# EAGLE design MoleNet_v5.0 (EAGLE 9.6.2)
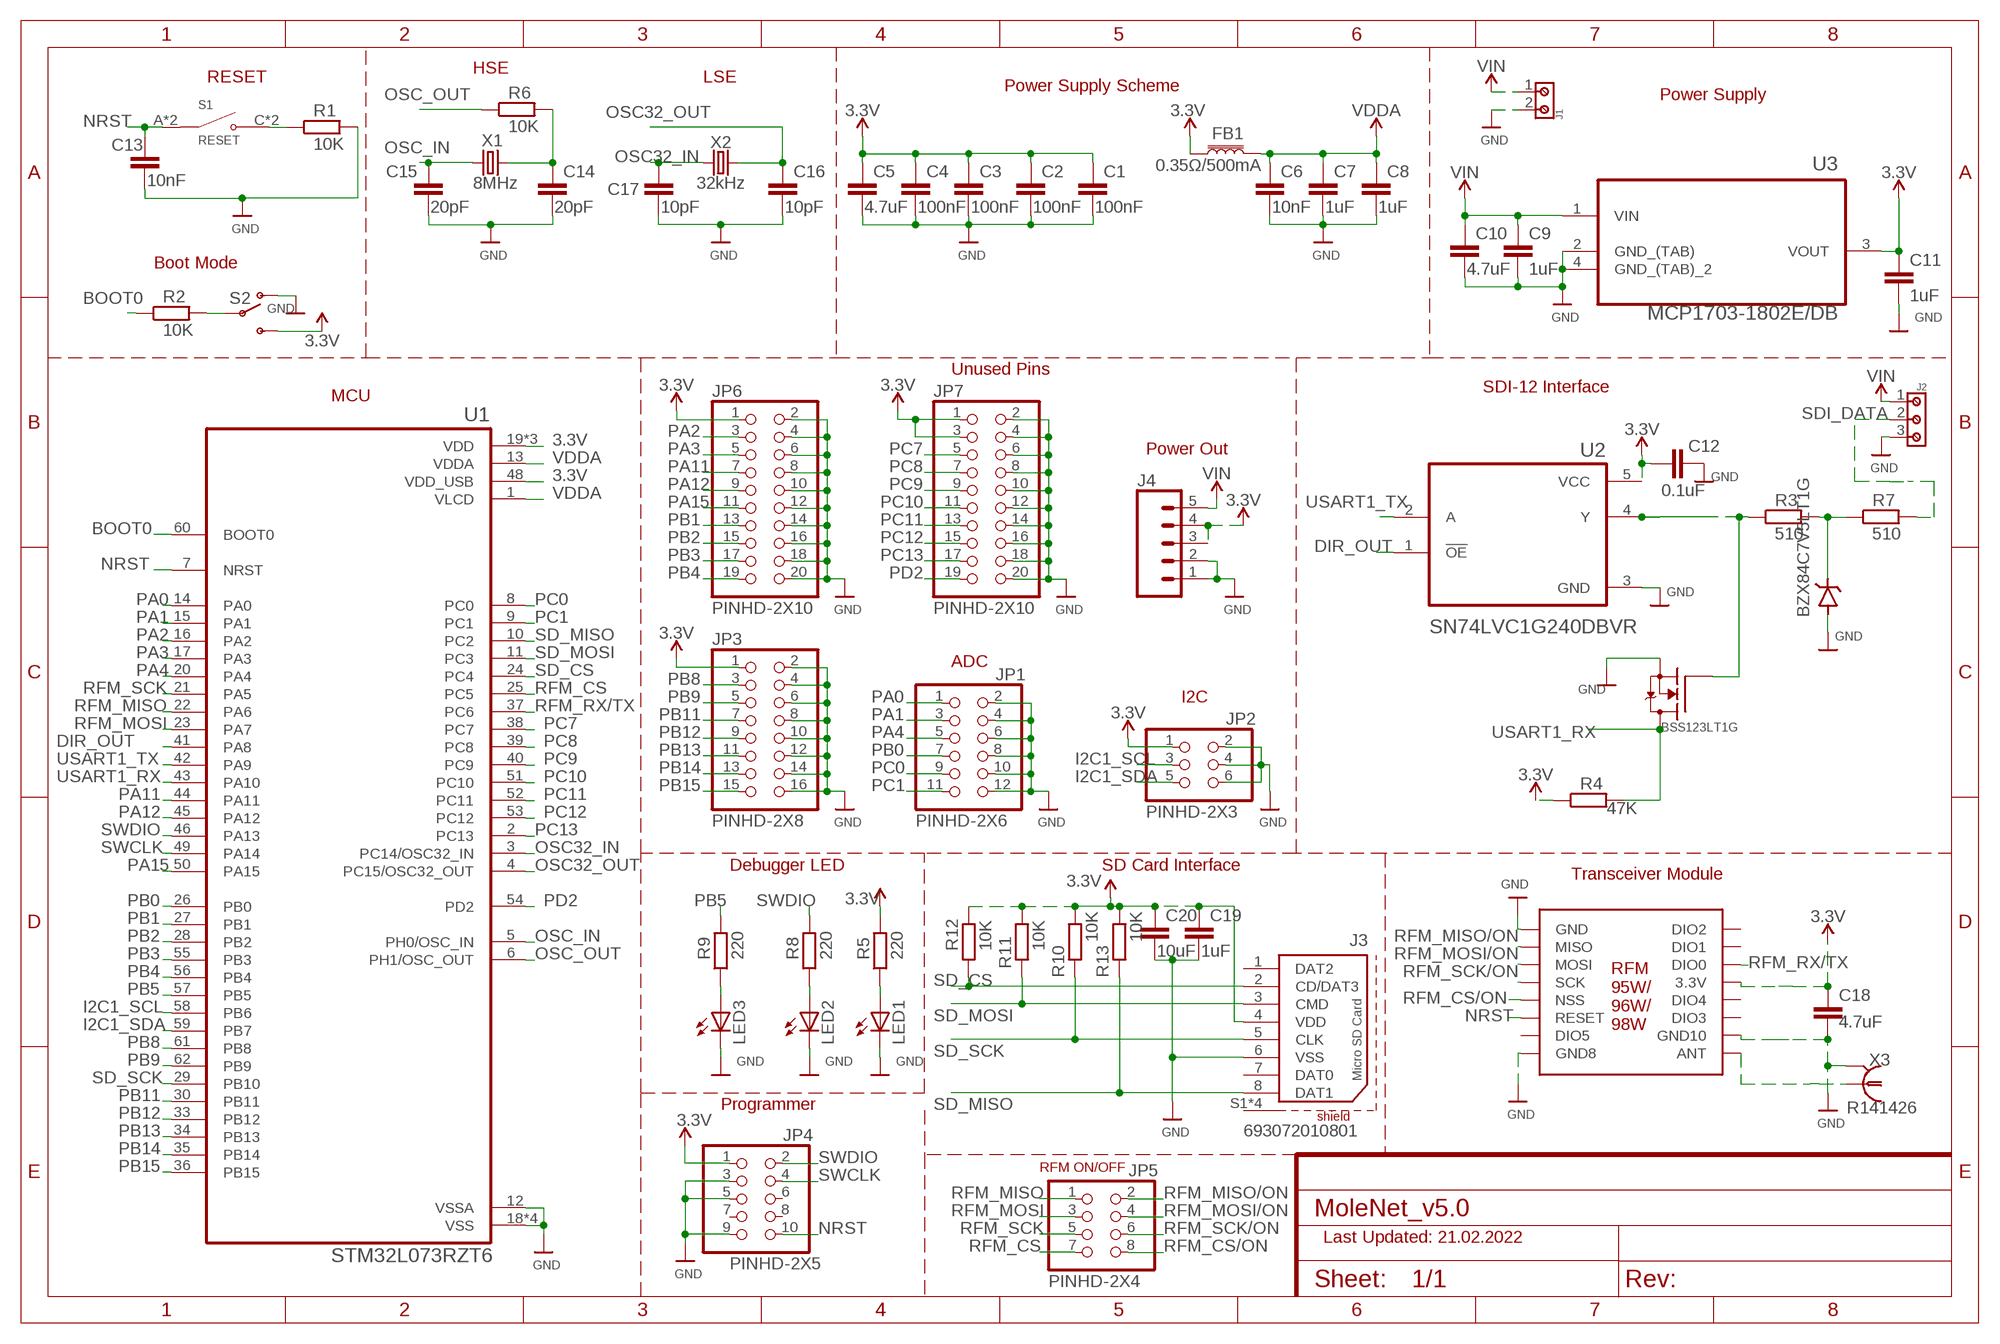
[diagram p0: schematic, sheet 1]

## Parts
C1  100nF  C-EUC0805  [C0805]
C2  100nF  C-EUC0805  [C0805]
C3  100nF  C-EUC0805  [C0805]
C4  100nF  C-EUC0805  [C0805]
C5  4.7uF  C-EUC0805  [C0805]
C6  10nF  C-EUC0805  [C0805]
C7  1uF  C-EUC0805  [C0805]
C8  1uF  C-EUC0805  [C0805]
C9  1uF  C-EUC0805  [C0805]
C10  4.7uF  C-EUC0805  [C0805]
C11  1uF  C-EUC0805  [C0805]
C12  0.1uF  C-EUC0805  [C0805]
C13  10nF  C-EUC0805  [C0805]
C14  20pF  C-EUC0805  [C0805]
C15  20pF  C-EUC0805  [C0805]
C16  10pF  C-EUC0805  [C0805]
C17  10pF  C-EUC0805  [C0805]
C18  4.7uF  C-EUC0805  [C0805]
C19  1uF  C-EUC0805  [C0805]
C20  10uF  C-EUC0805  [C0805]
FB1  0.35Ω/500mA  FERRITE_BEAD-0603  [0603]
J1  691216710002  [691216710002]
J2  691216510003S  [691216510003S]
J3  693072010801  [693072010801]
J4  CONN_05  [1X05]
JP1  PINHD-2X6  [2X06]
JP2  PINHD-2X3  [2X03]
JP3  PINHD-2X8  [2X08]
JP4  PINHD-2X5  [2X05]
JP5  PINHD-2X4  [2X04]
JP6  PINHD-2X10  [2X10]
JP7  PINHD-2X10  [2X10]
LED1  LEDCHIPLED_0805  [CHIPLED_0805]
LED2  LEDCHIPLED_0805  [CHIPLED_0805]
LED3  LEDCHIPLED_0805  [CHIPLED_0805]
R1  10K  R-EU_R0805  [R0805]
R2  10K  R-EU_R0805  [R0805]
R3  510  R-EU_R0805  [R0805]
R4  47K  R-EU_R0805  [R0805]
R5  220  R-EU_R0805  [R0805]
R6  10K  R-EU_R0805  [R0805]
R7  510  R-EU_R0805  [R0805]
R8  220  R-EU_R0805  [R0805]
R9  220  R-EU_R0805  [R0805]
R10  10K  R-EU_R0805  [R0805]
R11  10K  R-EU_R0805  [R0805]
R12  10K  R-EU_R0805  [R0805]
R13  10K  R-EU_R0805  [R0805]
S1  RESET  TS-1187A-B-A-B  [SW_TS-1187A-B-A-B]
S2  SWITCH-SPDTSMD  [SWITCH_SPDT_SMD]
U1  STM32L073RZT6  [QFP50P1200X1200X160-64N]
U2  SN74LVC1G240DBVR  [SOT95P280X145-5N]
U3  MCP1703-1802E/DB  [SOT230P700X180-4N]
U$18  RFM95W/96W/98W  [RFM95W/96W/98W]
U$32  BSS123LT1G_STYLE-21  [BZX84C7V5LT1G]
U$34  BZX84C7V5LT1G_STYLE-8  [BZX84C7V5LT1G]
X1  8MHz  CRYSTALHC49S  [HC49/S]
X2  32kHz  CRYSTAL-32.768KHZSMD-3.2X1.5  [CRYSTAL-SMD-3.2X1.5MM]
X3  R141426  [R141426]

## Nets
3.3V: C1.1 C2.1 C3.1 C4.1 C5.1 C11.1 C12.2 C18.1 C19.1 C20.1 FB1.1 J3.4(VDD) J4.3 J4.4 JP2.1 JP3.1 JP4.1 JP6.1 JP7.1 JP7.3 R4.1 R5.2 R10.2 R11.2 R12.2 R13.2 S2.3(S) U1.19(VDD) U1.32(VDD) U1.48(VDD_USB) U1.64(VDD) U2.5(VCC) U3.3(VOUT) U$18.13(3.3V)
BOOT0: R2.1 U1.60(BOOT0)
DIR_OUT: U1.41(PA8) U2.1(!OE)
GND: C1.2 C2.2 C3.2 C4.2 C5.2 C6.2 C7.2 C8.2 C9.2 C10.2 C11.2 C12.1 C13.2 C14.2 C15.2 C16.2 C17.2 C18.2 C19.2 C20.2 J1.2 J2.3 J3.6(VSS) J4.1 J4.2 JP1.2 JP1.4 JP1.6 JP1.8 JP1.10 JP1.12 JP2.2 JP2.4 JP2.6 JP3.2 JP3.4 JP3.6 JP3.8 JP3.10 JP3.12 JP3.14 JP3.16 JP4.3 JP4.5 JP4.9 JP6.2 JP6.4 JP6.6 JP6.8 JP6.10 JP6.12 JP6.14 JP6.16 JP6.18 JP6.20 JP7.2 JP7.4 JP7.6 JP7.8 JP7.10 JP7.12 JP7.14 JP7.16 JP7.18 JP7.20 LED1.C LED2.C LED3.C R1.2 S2.1(O) U1.12(VSSA) U1.18(VSS) U1.31(VSS) U1.47(VSS) U1.63(VSS) U2.3(GND) U3.2(GND_(TAB)) U3.4(GND_(TAB)_2) U$18.1(GND) U$18.8(GND8) U$18.10(GND10) U$32.P$2(S) U$34.P$1(A) X3.2 X3.3 X3.4 X3.5
I2C1_SCL: JP2.3 U1.58(PB6)
I2C1_SDA: JP2.5 U1.59(PB7)
N$1: R1.1 S1.C(NO) S1.D(NO)
N$2: R3.2 R7.1 U$34.P$3(C)
N$3: R3.1 U2.4(Y) U$32.P$1(G)
N$4: R2.2 S2.2(P)
N$5: C14.1 R6.2 X1.2
N$6: U$18.9(ANT) X3.1
N$7: LED1.A R5.1
N$8: LED2.A R8.1
N$9: LED3.A R9.1
NRST: C13.1 JP4.10 S1.A(COM) S1.B(COM) U1.7(NRST) U$18.6(RESET)
OSC32_IN: C17.1 U1.3(PC14/OSC32_IN) X2.P$1
OSC32_OUT: C16.1 U1.4(PC15/OSC32_OUT) X2.P$2
OSC_IN: C15.1 U1.5(PH0/OSC_IN) X1.1
OSC_OUT: R6.1 U1.6(PH1/OSC_OUT)
PA0: JP1.1 U1.14(PA0)
PA1: JP1.3 U1.15(PA1)
PA2: JP6.3 U1.16(PA2)
PA3: JP6.5 U1.17(PA3)
PA4: JP1.5 U1.20(PA4)
PA11: JP6.7 U1.44(PA11)
PA12: JP6.9 U1.45(PA12)
PA15: JP6.11 U1.50(PA15)
PB0: JP1.7 U1.26(PB0)
PB1: JP6.13 U1.27(PB1)
PB2: JP6.15 U1.28(PB2)
PB3: JP6.17 U1.55(PB3)
PB4: JP6.19 U1.56(PB4)
PB5: R9.2 U1.57(PB5)
PB8: JP3.3 U1.61(PB8)
PB9: JP3.5 U1.62(PB9)
PB11: JP3.7 U1.30(PB11)
PB12: JP3.9 U1.33(PB12)
PB13: JP3.11 U1.34(PB13)
PB14: JP3.13 U1.35(PB14)
PB15: JP3.15 U1.36(PB15)
PC0: JP1.9 U1.8(PC0)
PC1: JP1.11 U1.9(PC1)
PC7: JP7.5 U1.38(PC7)
PC8: JP7.7 U1.39(PC8)
PC9: JP7.9 U1.40(PC9)
PC10: JP7.11 U1.51(PC10)
PC11: JP7.13 U1.52(PC11)
PC12: JP7.15 U1.53(PC12)
PC13: JP7.17 U1.2(PC13)
PD2: JP7.19 U1.54(PD2)
RFM_CS: JP5.7 U1.25(PC5)
RFM_CS/ON: JP5.8 U$18.5(NSS)
RFM_MISO: JP5.1 U1.22(PA6)
RFM_MISO/ON: JP5.2 U$18.2(MISO)
RFM_MOSI: JP5.3 U1.23(PA7)
RFM_MOSI/ON: JP5.4 U$18.3(MOSI)
RFM_RX/TX: U1.37(PC6) U$18.14(DIO0)
RFM_SCK: JP5.5 U1.21(PA5)
RFM_SCK/ON: JP5.6 U$18.4(SCK)
SD_CS: J3.2(CD/DAT3) R12.1 U1.24(PC4)
SD_MISO: J3.8(DAT1) R13.1 U1.10(PC2)
SD_MOSI: J3.3(CMD) R11.1 U1.11(PC3)
SD_SCK: J3.5(CLK) R10.1 U1.29(PB10)
SDI_DATA: J2.2 R7.2
SWCLK: JP4.4 U1.49(PA14)
SWDIO: JP4.2 R8.2 U1.46(PA13)
USART1_RX: R4.2 U1.43(PA10) U$32.P$3(D)
USART1_TX: U1.42(PA9) U2.2(A)
VDDA: C6.1 C7.1 C8.1 FB1.2 U1.1(VLCD) U1.13(VDDA)
VIN: C9.1 C10.1 J1.1 J2.1 J4.5 U3.1(VIN)
Unconnected: J3.1(DAT2) J3.7(DAT0) J3.S1(SHIELD) J3.S2(SHIELD) J3.S3(SHIELD) J3.S4(SHIELD) JP4.6 JP4.7 JP4.8 U$18.7(DIO5) U$18.11(DIO3) U$18.12(DIO4) U$18.15(DIO1) U$18.16(DIO2)

## Notes on the sheet
- HSE
- RESET | LSE
- Power Supply Scheme
- Power Supply
- Boot Mode
- Unused Pins
- SDI-12 Interface
- MCU
- Power Out
- ADC
- I2C
- Debugger LED | SD Card Interface
- Transceiver Module
- Programmer
- RFM ON/OFF
- Last Updated: 21.02.2022

## Library data of the parts
C1-C20 = rcl:C-EU: CAPACITOR, European symbol; SPICEPREFIX: C
FB1 = SparkFun-Coils:FERRITE_BEAD: Ferrite Bead (blocks, cores, rings, chokes, etc.) Inductor with layers of ferrite used to suppress high frequencies. Often used to isolate high frequency noise. SparkFun Products: IOIO-OTG - V2.2 <https://www.sparkfun.com/products/13613> SparkFun SAMD21 Mini Breakout <https://www.sparkfun.com/products/13664> SparkFun 6 Degrees of Freedom Breakout - LSM6DS3 <https://www.sparkfun.com/products/13339> SparkFun SAMD21 Dev Breakout <https://www.sparkfun.com/products/13672>; PROD_ID: NDUC-07859; VALUE: 30Ω/1.8A
J1 = Wurth_Connectors_WR-TBL Rising Cage Clamp:691216710002: WR-TBL Serie 2167 - 5.00 mm Horizontal Entry Modular w. Rising Cage Clamp KIND PROPERTIES Pitch 5 mm MATERIAL PROPERTIES Insulator Material PA6/66 Insulator Flammability Rating UL94 V-0 Insulator Color Green Contact Material Copper Alloy Contact Plating Nickel over Tin Contact Type Stamped Terminal Screw Material Steel Terminal Screw Plating Zinc Wire Guard Material Copper Alloy GENERAL INFORMATION Operating Temperature -30 up to +120 °C Compliance Lead free / RoHS ELECTRICAL PROPERTIES IR UL 14 A IR VDE 24 A Working Voltage [UL] 300 V (AC) Working Voltage [VDE] 250 V (AC) Withstanding Voltage [UL] 1600 V (AC) Withstanding Voltage [VDE] 2000 V (AC) Contact Resistance 20 mΩ Contact Resistance [UL] 20 mΩ Contact Resistance [VDE] 20 mΩ MECHANICAL PROPERTIES Wire Strip Length 6 (mm) Screw M3 CERTIFICATION UL Approval E150931 CAT. N°: CLL (4) VDE Approval 40021356 VDE Approval 40021356 TYPE: CLL PACKAGING PROPERTIES Packaging Box <https://www.we-online.com/catalog/media/o32862v209%20Family_Con_TBL_Screw_RisingClamp_5_6912167100xx_pf2.jpg> Details see: https://www.we-online.com/catalog/en/TBL_5_00_2167_HORIZONTAL_ENTRY_W_RISING_CAGE_69121671000x/ Updated by Ella Wu 2019-11-22 2019(C) Wurth Elektronik; DATASHEET-URL: https://www.we-online.com/catalog/datasheet/691216710002.pdf; IR-UL: 14A; IR-VDE: 24A; MOUNT: THT; PART-NUMBER: 691216710002; PINS: 2; PITCH: 5mm; TYPE: Horizontal; WIRE: 30 to 12 (AWG) 0.05 to 3.31 (mm²); WORKING-VOLTAGE-UL: 300V (AC); WORKING-VOLTAGE-VDE: 250V (AC)
J2 = Wurth_Connectors_WR-TBL Rising Cage Clamp:691216510003S: WR-TBL Serie 2165S - 5.08 mm Horizontal Entry Modular w. Rising Cage Clamp KIND PROPERTIES Pitch 5.08 mm MATERIAL PROPERTIES Insulator Material PA66 Insulator Flammability Rating UL94 V-0 Contact Material Copper Alloy Contact Plating Tin over Nickel Contact Type Stamped Terminal Screw Material Steel Terminal Screw Plating Zinc Wire Guard Material Copper Alloy GENERAL INFORMATION Operating Temperature -30 up to +120 °C Compliance ROHS & Reach ELECTRICAL PROPERTIES IR UL 14 A IR VDE 24 A Working Voltage [UL] 300 V (AC) Working Voltage [VDE] 250 V (AC) Withstanding Voltage [UL] 1600 V (AC) Withstanding Voltage [VDE] 2000 V (AC) Contact Resistance 20 mΩ MECHANICAL PROPERTIES Wire Strip Length 6 Screw M3 CERTIFICATION UL Approval E150931 VDE Approval 40021356 PACKAGING PROPERTIES Packaging Box <https://www.we-online.com/catalog/media/o55598v209%20Family_Con_TBL_Screw_RisingClamp_5.08_6912165100xxS.psd.jpg> Details see: https://www.we-online.com/catalog/en/TBL_5_08_2165S_HORIZONTAL_ENTRY_W_RISING_CAGE_69121351000xS/ Updated by Ella Wu 2019-11-26 2019(C) Wurth Elektronik; IR-UL: 14A; IR-VDE: 24A; PART-NUMBER: 691216510003S; PINS: 3; PITCH: 5.08mm; TYPE: Horizontal; WIRE: 12 to 30 (AWG) 3.31 to 0.0509 (mm²); WORKING-VOLTAGE-UL: 300V (AC); WORKING-VOLTAGE-VDE: 250V (AC)
J3 = Wurth_Connectors_WR-CRD:693072010801: WR-CRD Micro SD Card Connector Hinge KIND PROPERTIES Quality Class 10 000 Mating cycles Gender Socket Type Hinge MATERIAL PROPERTIES Insulator Material LCP Insulator Flammability Rating UL94 V-0 Color Black Contact Material Copper Alloy Contact Plating Selective Gold;​ Contact Type Stamped Shielding Material：Stainless Steel GENERAL INFORMATION Operating Temperature -25 up to +85 °C;​ Compliance RoHS ELECTRICAL PROPERTIES IR 1：0.5A Working Voltage 100 V (AC) Withstanding Voltage 500 V (AC) Contact Resistance 100 mΩ <https://www.we-online.de/katalog/media/o33063v209%20Family_05_SMT_ZIF_Horizontal_p294_WR-FPC_6871xx182122_4C.jpg> Details see: https://www.we-online.de/katalog/en/CRD_SD_MICRO_HINGEL_8_PINS/ Updated by Ella Wu 2020-04-15 2020(C) Wurth Elektronik; DATASHEET-URL: https://www.we-online.com/catalog/datasheet/693072010801.pdf; GERDER: Socket; IR: 0.5A; MOUNT: SMT; PART-NUMBER: 693072010801; PINS: 8; TYPE: Hinge; WORKING-VOLTAGE: 100V(AC)
J4 = SparkFun-Connectors:CONN_05: Multi connection point. Often used as Generic Header-pin footprint for 0.1 inch spaced/style header connections On any of the 0.1 inch spaced packages, you can populate with these: Break Away Headers - Straight <https://www.sparkfun.com/products/116> (PRT-00116) Break Away Male Headers - Right Angle <https://www.sparkfun.com/products/553> (PRT-00553) Female Headers <https://www.sparkfun.com/products/115> (PRT-00115) Break Away Headers - Machine Pin <https://www.sparkfun.com/products/117> (PRT-00117) Break Away Female Headers - Swiss Machine Pin <https://www.sparkfun.com/products/743> (PRT-00743) For SCREWTERMINALS and SPRING TERMINALS visit here: Screw Terimnals on SparkFun.com <https://www.sparkfun.com/search/results?term=Screw+Terminals> (5mm/3.5mm/2.54mm spacing) This device is also useful as a general connection point to wire up your design to another part of your project. Our various solder wires solder well into these plated through hole pads. Hook-Up Wire - Assortment (Stranded, 22 AWG) <https://www.sparkfun.com/products/11375> (PRT-11375) Hook-Up Wire - Assortment (Solid Core, 22 AWG) <https://www.sparkfun.com/products/11367> (PRT-11367) View the entire wire category on our website here <https://www.sparkfun.com/categories/141> Special notes: Molex polarized connector foot print use with SKU : PRT-08231 with associated crimp pins and housings. 1MM SMD Version SKU: PRT-10208
JP1 = Connector:PINHD-2X6: PIN HEADER; CATEGORY: CONNECTOR; SUB-CATEGORY: PIN-HEADER
JP2 = Connector:PINHD-2X3: PIN HEADER; CATEGORY: CONNECTOR; SUB-CATEGORY: PIN-HEADER
JP3 = Connector:PINHD-2X8: PIN HEADER; CATEGORY: CONNECTOR; SUB-CATEGORY: PIN-HEADER
JP4 = Connector:PINHD-2X5: PIN HEADER; CATEGORY: CONNECTOR; SUB-CATEGORY: PIN-HEADER
JP5 = Connector:PINHD-2X4: PIN HEADER; CATEGORY: CONNECTOR; SUB-CATEGORY: PIN-HEADER
JP6 JP7 = Connector:PINHD-2X10: PIN HEADER; CATEGORY: CONNECTOR; SUB-CATEGORY: PIN-HEADER
LED1-LED3 = adafruit:LED: LED OSRAM: - CHIPLED LG R971, LG N971, LY N971, LG Q971, LY Q971, LO R971, LY R971 LH N974, LH R974 LS Q976, LO Q976, LY Q976 LO Q996 - Hyper CHIPLED LW Q18S LB Q993, LB Q99A, LB R99A - SideLED LS A670, LO A670, LY A670, LG A670, LP A670 LB A673, LV A673, LT A673, LW A673 LH A674 LY A675 LS A676, LA A676, LO A676, LY A676, LW A676 LS A679, LY A679, LG A679 - Hyper Micro SIDELED® LS Y876, LA Y876, LO Y876, LY Y876 LT Y87S - SmartLED LW L88C, LW L88S LB L89C, LB L89S, LG L890 LS L89K, LO L89K, LY L89K LS L896, LA L896, LO L896, LY L896 - TOPLED LS T670, LO T670, LY T670, LG T670, LP T670 LSG T670, LSP T670, LSY T670, LOP T670, LYG T670 LG T671, LOG T671, LSG T671 LB T673, LV T673, LT T673, LW T673 LH T674 LS T676, LA T676, LO T676, LY T676, LB T676, LH T676, LSB T676, LW T676 LB T67C, LV T67C, LT T67C, LS T67K, LO T67K, LY T67K, LW E67C LS E67B, LA E67B, LO E67B, LY E67B, LB E67C, LV E67C, LT E67C LW T67C LS T679, LY T679, LG T679 LS T770, LO T770, LY T770, LG T770, LP T770 LB T773, LV T773, LT T773, LW T773 LH T774 LS E675, LA E675, LY E675, LS T675 LS T776, LA T776, LO T776, LY T776, LB T776 LHGB T686 LT T68C, LB T68C - Hyper Mini TOPLED® LB M676 - Mini TOPLED Santana® LG M470 LS M47K, LO M47K, LY M47K Source: http://www.osram.convergy.de/
R1-R13 = resistor:R-EU_: RESISTOR, European symbol
S1 = TS-1187A-B-A-B:TS-1187A-B-A-B: SPST 50mA @ 12VDC Top Actuated Round Button 160gf SMD Tactile Switches RoHS Check availability <https://pricing.snapeda.com/parts/TS-1187A-B-A-B/XKB%20Industrial%20Precision/view-part?ref=eda>; AVAILABILITY: In Stock; DESCRIPTION: TS-1187A-B-A-B XKB Connectivity; MF: XKB Industrial Precision; MP: TS-1187A-B-A-B; PACKAGE: Package; PRICE: None
S2 = SparkFun-Retired:SWITCH-SPDT: SPDT Switch Simple slide switch, Spark Fun Electronics SKU : COM-00102 DPDT SMT slide switch, AYZ0202, SWCH-08179
U1 = STM32L073RZT6:STM32L073RZT6: None Check availability <https://pricing.snapeda.com/parts/STM32L073RZT6/STMicroelectronics/view-part?ref=eda>; AVAILABILITY: In Stock; DESCRIPTION: ARM® Cortex®-M0+ STM32L0 Microcontroller IC 32-Bit 32MHz 192KB (192K x 8) FLASH 64-LQFP (10x10); MF: STMicroelectronics; MP: STM32L073RZT6; PACKAGE: LQFP-64 STMicroelectronics; PRICE: None; PURCHASE-URL: https://pricing.snapeda.com/search/part/STM32L073RZT6/?ref=eda
U2 = SN74LVC1G240DBVR:SN74LVC1G240DBVR: Check availability <https://pricing.snapeda.com/parts/SN74LVC1G240DBVR/Texas%20Instruments/view-part?ref=eda>; AVAILABILITY: In Stock; DESCRIPTION: Single Inverting Buffer/Driver With 3-State Outputs 5-SOT-23 -40 to 125; MF: Texas Instruments; MP: SN74LVC1G240DBVR; PACKAGE: SOT-23-5 Texas Instruments; PRICE: None; PURCHASE-URL: https://pricing.snapeda.com/search/part/SN74LVC1G240DBVR/?ref=eda
U3 = MCP1703-1802E_DB:MCP1703-1802E/DB: IC REG LDO 3.3V 250MA Check availability <https://pricing.snapeda.com/parts/MCP1703-1802E/DB/Microchip/view-part?ref=eda>; AVAILABILITY: In Stock; DESCRIPTION: MCP1703-1802E/DB,LDOVoltage Regulator,200mA,1.8V 2%,2.7 to 16Vin,3-Pin SOT-223; MF: Microchip; MP: MCP1703-1802E/DB; PACKAGE: SOT-223 Microchip Technology; PRICE: None; PURCHASE-URL: https://pricing.snapeda.com/search/part/MCP1703-1802E/DB/?ref=eda
U$18 = RFM95W-96W-98W:RFM95W/96W/98W: RFM95/96/97/98（W） https://www.rfsolutions.co.uk/downloads/1463993415RFM95_96_97_98W.pdf
U$32 = BSS123LT1G:BSS123LT1G_STYLE-21
U$34 = BZX84C7V5LT1G:BZX84C7V5LT1G_STYLE-8
X1 = crystal:CRYSTAL: CRYSTAL; OC_FARNELL: 1667008; OC_NEWARK: unknown
X2 = SparkFun-Clocks:CRYSTAL-32.768KHZ: 32.768kHz Crystal Frequency: 32.768kHz Frequency Stability: ±20ppm Load Capacitance: 12.5pF (PTH-2X6 & SMD-3.2X1.5), 6pF (SMD-2X6) SparkFun Products: SparkFun BigTime Watch Kit <https://www.sparkfun.com/products/11734> SparkFun nRF52832 Breakout <https://www.sparkfun.com/products/13990> SparkFun Real Time Clock Module <https://www.sparkfun.com/products/12708>; PROD_ID: XTAL-13062; VALUE: 32.768kHz
X3 = con-coax:R141426: BNC COAX CONNECTOR Radiall 50/75 Ohm Spoerle; MF: FARNELL; MPN: R141426161; OC_FARNELL: 4195115; OC_NEWARK: 14J7919

## Board
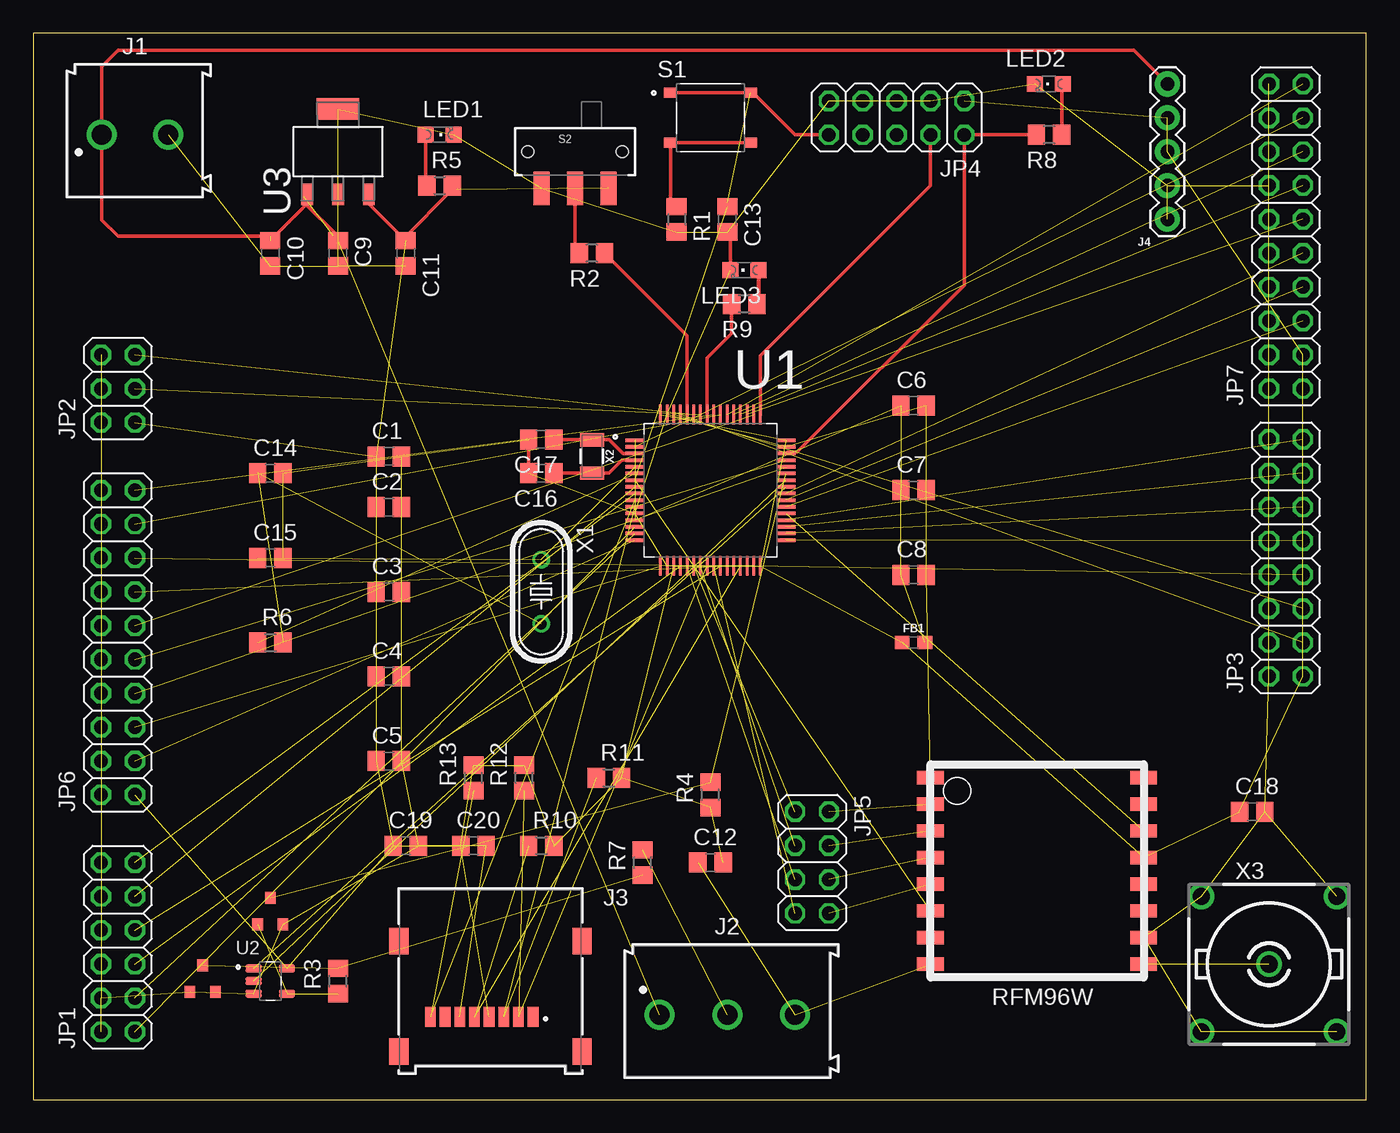
[diagram p1: board, top side]

Size 100 x 80 mm. Coordinates in mm from the lower left corner, seen from the top.
Outline: 0,0 100,0 100,80 0,80 0,0
Copper layers (1*16): Top 0.035mm / dielectric 1.5mm / Bottom 0.035mm
Design rules "default": minimum track width 6mil, minimum drill 0.35mm, track to track 6mil, track to pad 6mil, pad to pad 6mil, via to via 6mil, smd to smd 6mil, copper to edge 40mil, drill to drill 6mil, minimum pad ring 10mil, minimum via ring 8mil, stop-mask expansion 4mil, vias tented up to drill 0mil, thermal gap 10mil

### Footprints (pad centres in the part's own frame; a part is rotated, then mirrored left to right if it is on the bottom)
C0805 = smd 1.3 x 1.5: 1 -0.95,0; 2 0.95,0
0603 = smd 1.1 x 1: 1 -0.85,0; 2 0.85,0
691216710002 = drill 1.5: 1 -2.5,0; 2 2.5,0
691216510003S = drill 1.5: 1 -5.08,0; 2 0,0; 3 5.08,0
693072010801 = smd 0.8 x 1.5: 1 3.2,-2.7; 2 2.1,-2.7; 3 1,-2.7; 4 -0.1,-2.7; 5 -1.2,-2.7; 6 -2.3,-2.7; 7 -3.4,-2.7; 8 -4.5,-2.7 | smd 1.45 x 2: S1 -6.875,3; S2 6.875,3; S3 -6.875,-5.3; S4 6.875,-5.3
1X05 = drill 1.016 pad 1.88: 1 0,0; 2 2.54,0; 3 5.08,0; 4 7.62,0; 5 10.16,0
2X06 = drill 1.016 octagon: 1 -6.35,-1.27; 2 -6.35,1.27; 3 -3.81,-1.27; 4 -3.81,1.27; 5 -1.27,-1.27; 6 -1.27,1.27; 7 1.27,-1.27; 8 1.27,1.27; 9 3.81,-1.27; 10 3.81,1.27; 11 6.35,-1.27; 12 6.35,1.27
2X03 = drill 1.016 octagon: 1 -2.54,-1.27; 2 -2.54,1.27; 3 0,-1.27; 4 0,1.27; 5 2.54,-1.27; 6 2.54,1.27
2X08 = drill 1.016 octagon: 1 -8.89,-1.27; 2 -8.89,1.27; 3 -6.35,-1.27; 4 -6.35,1.27; 5 -3.81,-1.27; 6 -3.81,1.27; 7 -1.27,-1.27; 8 -1.27,1.27; 9 1.27,-1.27; 10 1.27,1.27; 11 3.81,-1.27; 12 3.81,1.27; 13 6.35,-1.27; 14 6.35,1.27; 15 8.89,-1.27; 16 8.89,1.27
2X05 = drill 1.016 octagon: 1 -5.08,-1.27; 2 -5.08,1.27; 3 -2.54,-1.27; 4 -2.54,1.27; 5 0,-1.27; 6 0,1.27; 7 2.54,-1.27; 8 2.54,1.27; 9 5.08,-1.27; 10 5.08,1.27
2X04 = drill 1.016 octagon: 1 -3.81,-1.27; 2 -3.81,1.27; 3 -1.27,-1.27; 4 -1.27,1.27; 5 1.27,-1.27; 6 1.27,1.27; 7 3.81,-1.27; 8 3.81,1.27
2X10 = drill 1.016 octagon: 1 -11.43,-1.27; 2 -11.43,1.27; 3 -8.89,-1.27; 4 -8.89,1.27; 5 -6.35,-1.27; 6 -6.35,1.27; 7 -3.81,-1.27; 8 -3.81,1.27; 9 -1.27,-1.27; 10 -1.27,1.27; 11 1.27,-1.27; 12 1.27,1.27; 13 3.81,-1.27; 14 3.81,1.27; 15 6.35,-1.27; 16 6.35,1.27; 17 8.89,-1.27; 18 8.89,1.27; 19 11.43,-1.27; 20 11.43,1.27
CHIPLED_0805 = smd 1.2 x 1.2: A 0,-1.05; C 0,1.05
R0805 = smd 1.3 x 1.5: 1 -0.95,0; 2 0.95,0
SW_TS-1187A-B-A-B = smd 1 x 0.75: A -3,1.875; B 3,1.875; C -3,-1.875; D 3,-1.875
SWITCH_SPDT_SMD = smd 1.2 x 2.5: 1 -2.5,-2.75; 2 0,-2.75; 3 2.5,-2.75 | hole 0.9: -3.55,0; 3.55,0
QFP50P1200X1200X160-64N = smd 1.47 x 0.25: 1 -5.67,3.75; 2 -5.67,3.25; 3 -5.67,2.75; 4 -5.67,2.25; 5 -5.67,1.75; 6 -5.67,1.25; 7 -5.67,0.75; 8 -5.67,0.25; 9 -5.67,-0.25; 10 -5.67,-0.75; 11 -5.67,-1.25; 12 -5.67,-1.75; 13 -5.67,-2.25; 14 -5.67,-2.75; 15 -5.67,-3.25; 16 -5.67,-3.75; 33 5.67,-3.75; 34 5.67,-3.25; 35 5.67,-2.75; 36 5.67,-2.25; 37 5.67,-1.75; 38 5.67,-1.25; 39 5.67,-0.75; 40 5.67,-0.25; 41 5.67,0.25; 42 5.67,0.75; 43 5.67,1.25; 44 5.67,1.75; 45 5.67,2.25; 46 5.67,2.75; 47 5.67,3.25; 48 5.67,3.75 | smd 0.25 x 1.47: 17 -3.75,-5.67; 18 -3.25,-5.67; 19 -2.75,-5.67; 20 -2.25,-5.67; 21 -1.75,-5.67; 22 -1.25,-5.67; 23 -0.75,-5.67; 24 -0.25,-5.67; 25 0.25,-5.67; 26 0.75,-5.67; 27 1.25,-5.67; 28 1.75,-5.67; 29 2.25,-5.67; 30 2.75,-5.67; 31 3.25,-5.67; 32 3.75,-5.67; 49 3.75,5.67; 50 3.25,5.67; 51 2.75,5.67; 52 2.25,5.67; 53 1.75,5.67; 54 1.25,5.67; 55 0.75,5.67; 56 0.25,5.67; 57 -0.25,5.67; 58 -0.75,5.67; 59 -1.25,5.67; 60 -1.75,5.67; 61 -2.25,5.67; 62 -2.75,5.67; 63 -3.25,5.67; 64 -3.75,5.67
SOT95P280X145-5N = smd 1.21 x 0.59: 1 -1.255,0.95; 2 -1.255,0; 3 -1.255,-0.95; 4 1.255,-0.95; 5 1.255,0.95
SOT230P700X180-4N = smd 1.626 x 0.889: 1 -3.2,2.311; 2 -3.2,0; 3 -3.2,-2.311 | smd 1.626 x 3.175: 4 3.2,0
RFM95W/96W/98W = smd 2 x 1: 1 0,14; 2 0,12; 3 0,10; 4 0,8; 5 0,6; 6 0,4; 7 0,2; 8 0,0; 9 16,0; 10 16,2; 11 16,4; 12 16,6; 13 16,8; 14 16,10; 15 16,12; 16 16,14
BZX84C7V5LT1G = smd 0.8 x 0.9: P$1 -0.95,0.45; P$2 0.95,0.45; P$3 0,2.45
HC49/S = drill 0.813: 1 -2.413,0; 2 2.413,0
CRYSTAL-SMD-3.2X1.5MM = smd 1 x 1.8: P$1 -1.25,0; P$2 1.25,0
R141426 = drill 1.295: 1 0,0; 2 5.08,5.08; 3 -5.08,5.08; 4 -5.08,-5.08; 5 5.08,-5.08

### Placement (x,y rotation side)
C1  26.67,48.26 0 top
C2  26.67,44.45 0 top
C3  26.67,38.1 0 top
C4  26.67,31.75 0 top
C5  26.67,25.4 0 top
C6  66.04,52.07 0 top
C7  66.04,45.72 0 top
C8  66.04,39.37 0 top
C9  22.86,63.5 270 top
C10  17.78,63.5 270 top
C11  27.94,63.5 270 top
C12  50.8,17.78 0 top
C13  52.07,66.04 270 top
C14  17.78,46.99 0 top
C15  17.78,40.64 0 top
C16  38.1,46.99 180 top
C17  38.1,49.53 180 top
C18  91.44,21.59 0 top
C19  27.94,19.05 0 top
C20  33.02,19.05 0 top
FB1  66.04,34.29 0 top
J1  7.62,72.39 0 top
J2  52.07,6.35 0 top
J3  34.29,8.89 0 top
J4  85.09,66.04 90 top
JP1  6.35,11.43 90 top
JP2  6.35,53.34 90 top
JP3  93.98,40.64 90 top
JP4  64.77,73.66 180 top
JP5  58.42,17.78 270 top
JP6  6.35,34.29 90 top
JP7  93.98,64.77 90 top
LED1  30.48,72.39 270 top
LED2  76.2,76.2 90 top
LED3  53.34,62.23 90 top
R1  48.26,66.04 270 top
R2  41.91,63.5 180 top
R3  22.86,8.89 90 top
R4  50.8,22.86 90 top
R5  30.48,68.58 0 top
R6  17.78,34.29 0 top
R7  45.72,17.78 90 top
R8  76.2,72.39 180 top
R9  53.34,59.69 180 top
R10  38.1,19.05 0 top
R11  43.18,24.13 0 top
R12  36.83,24.13 90 top
R13  33.02,24.13 90 top
S1  50.8,73.66 0 top
S2  40.64,71.12 0 top
U1  50.8,45.72 0 top
U2  17.78,8.89 0 top
U3  22.86,71.12 90 top
U$18  67.31,10.16 0 top
U$32  17.78,12.7 0 top
U$34  12.7,7.62 0 top
X1  38.1,38.1 270 top
X2  41.91,48.26 270 top
X3  92.71,10.16 0 top

### Tracks (layer width: path | path; a pad name or v marks a point on that pad's centre or on a via)
3.3V  (31 unrouted)
  Top 0.254: C11.1 27.78,64.61 | 27.78,64.61 25.17,67.22 U3.3 | R5.2 31.43,68.26 27.78,64.61
  Top 0.305: C11.1 28.26,64.77 | 31.75,68.26 R5.2
BOOT0
  Top 0.254: U1.60 49.05,57.31 R2.1
DIR_OUT  (1 unrouted)
GND  (84 unrouted)
  Top 0.254: 52.29,64.87 LED3.C | C17.2 C16.2
  Top 0.305: C13.2 52.29,64.87
I2C1_SCL  (1 unrouted)
I2C1_SDA  (1 unrouted)
N$1
  Top 0.254: R1.1 47.8,67.45 S1.C S1.D
N$2  (2 unrouted)
N$3  (2 unrouted)
N$4
  Top 0.254: 40.64,63.82 S2.2
  Top 0.305: R2.2 40.64,63.82
N$5  (2 unrouted)
N$6  (1 unrouted)
N$7
  Top 0.254: 29.43,68.68 LED1.A
  Top 0.305: R5.1 29.43,68.68
N$8
  Top 0.254: R8.1 77.15,76.1 LED2.A
N$9
  Top 0.305: LED3.A 54.39,59.79 R9.1
NRST  (3 unrouted)
  Top 0.254: S1.A S1.B 54.01,75.53 57.15,72.39 JP4.10
  Top 0.305: 52.07,67.31 C13.1 | S1.B 53.95,75.53
OSC32_IN
  Top 0.254: U1.3 44.24,48.47 43.18,49.53 41.93,49.53 X2.P$1 41.89,49.53 C17.1
OSC32_OUT
  Top 0.254: U1.4 44.16,47.97 43.18,46.99 41.93,46.99 X2.P$2 41.89,46.99 C16.1
OSC_IN  (2 unrouted)
OSC_OUT  (1 unrouted)
PA0  (1 unrouted)
PA1  (1 unrouted)
PA2  (1 unrouted)
PA3  (1 unrouted)
PA4  (1 unrouted)
PA11  (1 unrouted)
PA12  (1 unrouted)
PA15  (1 unrouted)
PB0  (1 unrouted)
PB1  (1 unrouted)
PB2  (1 unrouted)
PB3  (1 unrouted)
PB4  (1 unrouted)
PB5
  Top 0.254: U1.57 50.55,55.63 52.39,57.47 R9.2
PB8  (1 unrouted)
PB9  (1 unrouted)
PB11  (1 unrouted)
PB12  (1 unrouted)
PB13  (1 unrouted)
PB14  (1 unrouted)
PB15  (1 unrouted)
PC0  (1 unrouted)
PC1  (1 unrouted)
PC7  (1 unrouted)
PC8  (1 unrouted)
PC9  (1 unrouted)
PC10  (1 unrouted)
PC11  (1 unrouted)
PC12  (1 unrouted)
PC13  (1 unrouted)
PD2  (1 unrouted)
RFM_CS  (1 unrouted)
RFM_CS/ON  (1 unrouted)
RFM_MISO  (1 unrouted)
RFM_MISO/ON  (1 unrouted)
RFM_MOSI  (1 unrouted)
RFM_MOSI/ON  (1 unrouted)
RFM_RX/TX  (1 unrouted)
RFM_SCK  (1 unrouted)
RFM_SCK/ON  (1 unrouted)
SD_CS  (2 unrouted)
SD_MISO  (2 unrouted)
SD_MOSI  (2 unrouted)
SD_SCK  (2 unrouted)
SDI_DATA  (1 unrouted)
SWCLK
  Top 0.254: U1.49 54.55,55.82 67.31,68.58 JP4.4
SWDIO
  Top 0.254: R8.2 JP4.2 69.85,61.11 57.3,48.57 56.57,48.57 U1.46
USART1_RX  (2 unrouted)
USART1_TX  (1 unrouted)
VDDA  (5 unrouted)
VIN  (3 unrouted)
  Top 0.254: 17.78,64.77 6.35,64.77 5.12,66 J1.1 5.12,77.51 6.35,78.74 82.55,78.74 J4.5 | C10.1 20.32,66.99 20.32,67.31 22.86,64.77 C9.1
  Top 0.305: U3.1 20.32,67.69 | C9.1 22.54,64.77